# Altium schematic sheet Sheet1[1].SchDoc
size A; SheetNumber: 2; SheetTotal: 3; SPICEModelCacheXMSPVYCF: <root> / <DocumentId>XMSPVYCF</DocumentId> / <CacheFrame Number="0"> / <Model Name="18tq045" Kind="MDL"> / <Text>************************************** / *      Model Generated by MODPEX     * / *Copyright(c) Symmetry Design Systems* / *         All Rights Reserved        * / *    UNPUBLISHED LICENSED SOFTWARE   * / *   Contains Proprietary Information * / *      Which is The Property of      * / *     SYMMETRY OR ITS LICENSORS      * / *Commercial Use or Resale Restricted * / *   by Symmetry License Agreement    * / ************************************** / * Model generated on Sep 17, 96 / * MODEL FORMAT: SPICE3 / .MODEL 18tq045 d / +( / +IS=1.97424e-13 RS=0.00628392 N=0.530234 EG=0.6 / +XTI=0.05 BV=45 IBV=0.0001 CJO=8.24939e-09 / +VJ=1.5 M=0.462568 FC=0.5 TT=0 / +KF=0 AF=1 / +)</Text> / </Model> / </CacheFrame> / </root>
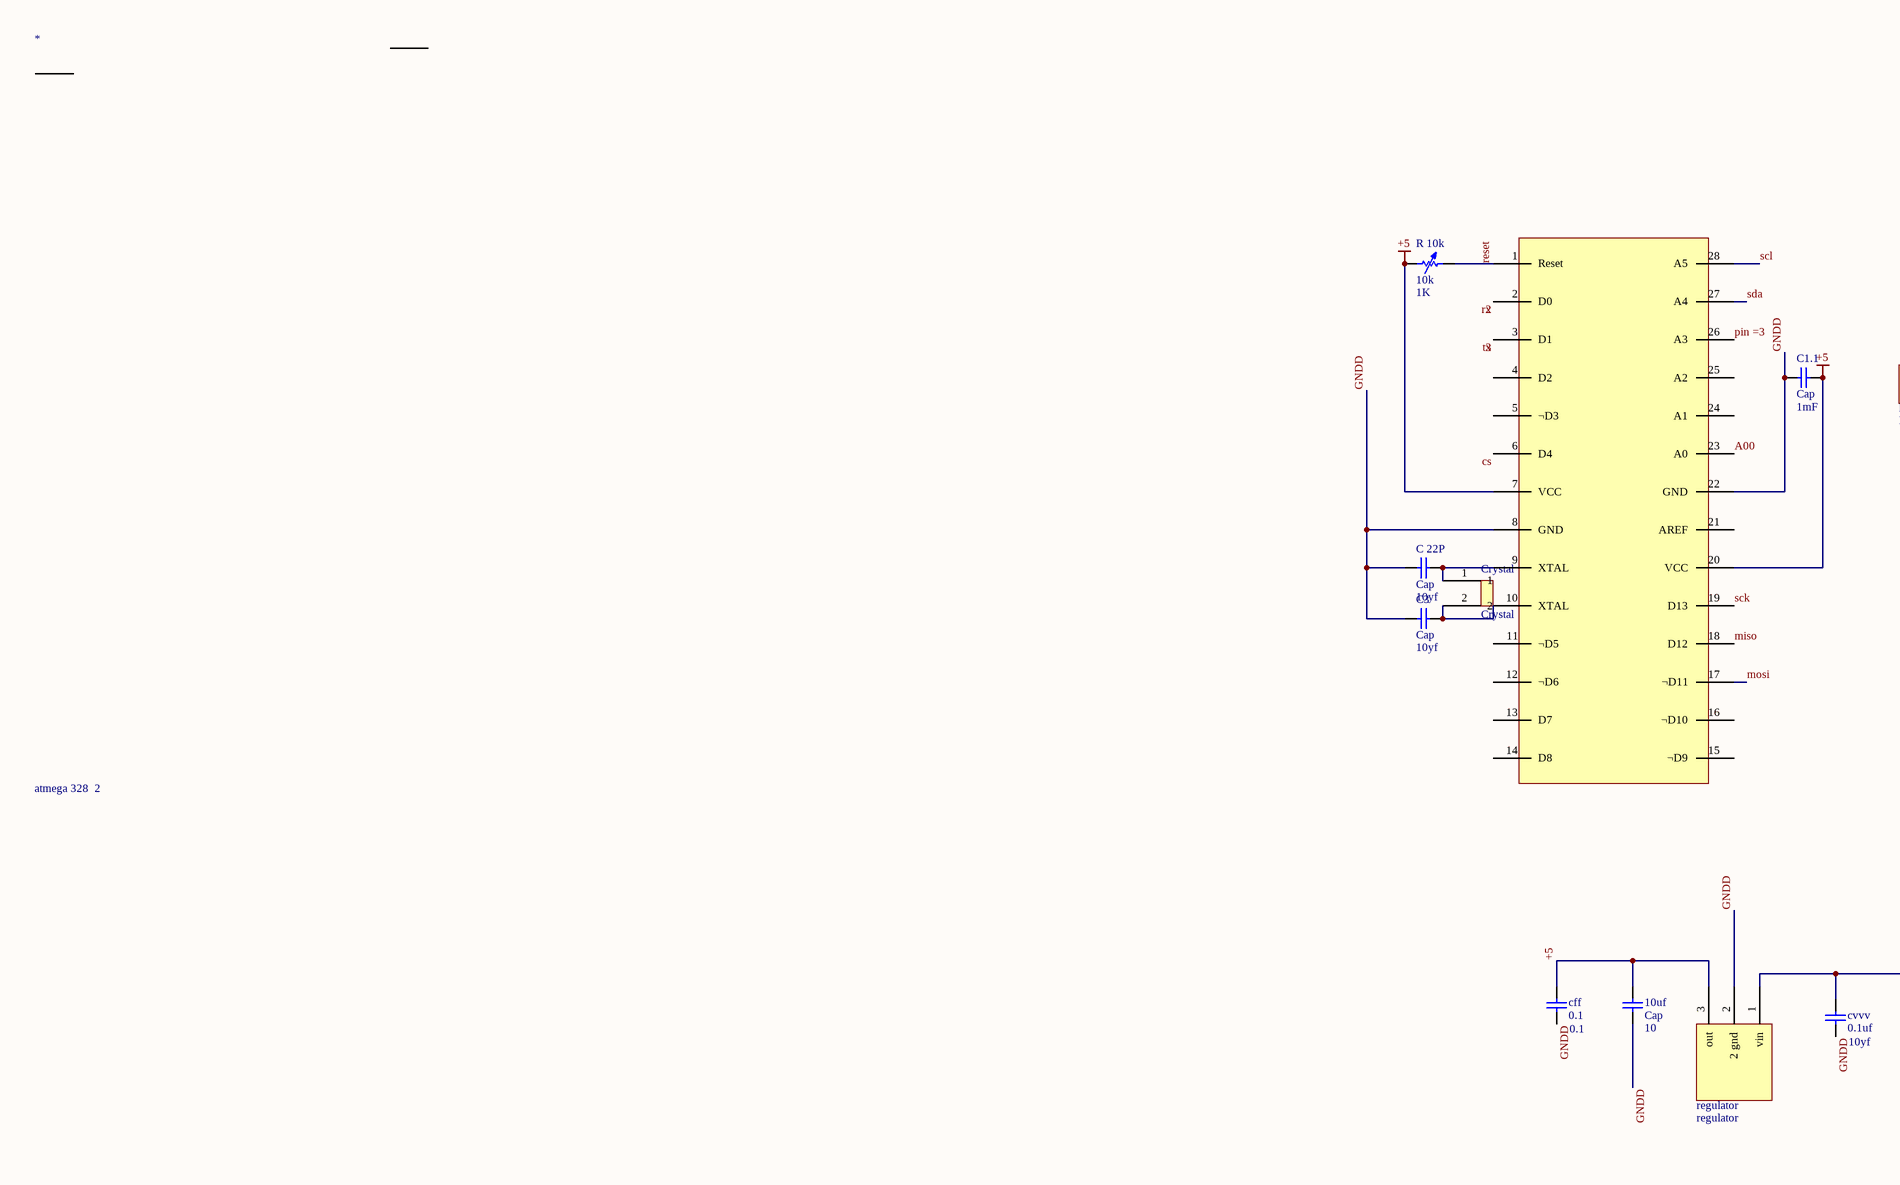
[diagram p0: Sheet1[1].SchDoc, left]
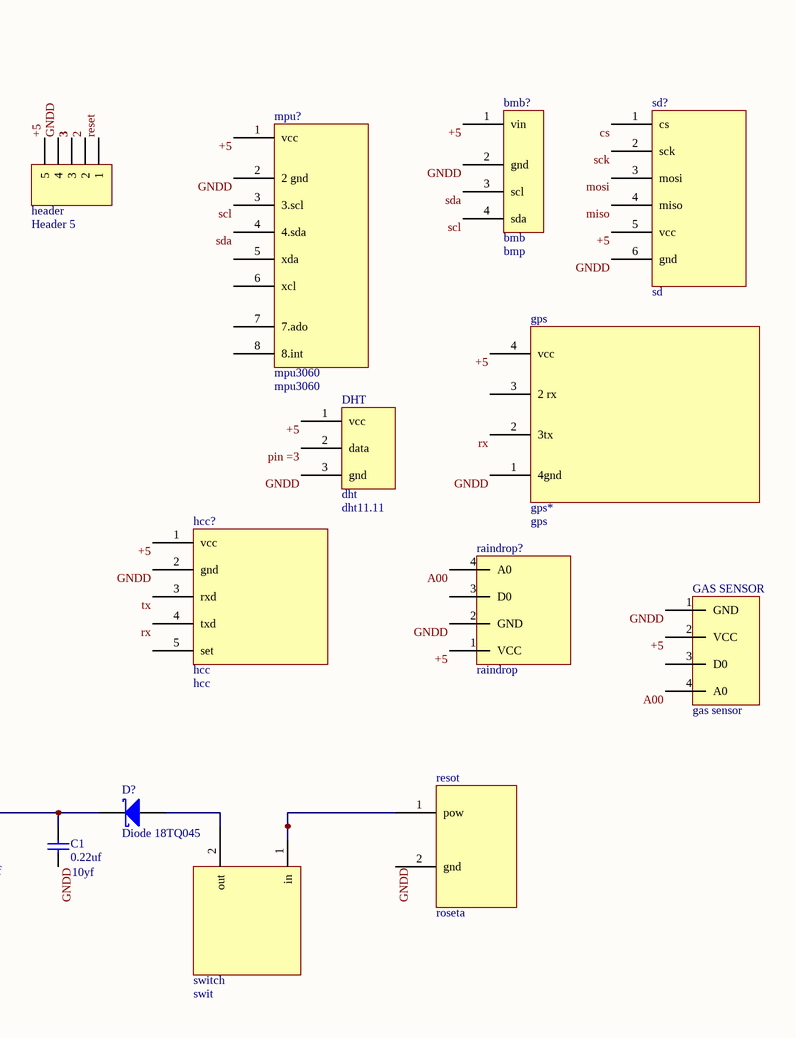
[diagram p1: Sheet1[1].SchDoc, right]

## Parts
10uf  Cap  value 10  [RAD-0.3]
*  atmega 328  2  [atmega 328p]
bmb?  bmb  [bmp - duplicate]
C1  0.22uf  10uf: 10yf  [RAD-0.3]
C1.1  Cap  value 1mF  [RAD-0.3]
C3  Cap  10uf: 10yf  [RAD-0.3]
C_22P  Cap  10uf: 10yf  [RAD-0.3]
cff  0.1  [RAD-0.3]
Crystal  Crystal  [cristal]
cvvv  0.1uf  10uf: 10yf  [RAD-0.3]
D?  Diode 18TQ045  [TO-220AC]
DHT  dht  [dht11.11]
GAS_SENSOR  gas sensor  [gas sensor]
gps  gps*  [GPS]
hcc?  hcc  [hc-12]
header  Header 5  [HDR1X5]
mpu?  mpu3060  [mpu 6050.11]
R_10k  10k  value 1K  [AXIAL-0.7]
raindrop?  raindrop  [raindrop]
regulator  regulator  [regylator]
resot  roseta  [roseta]
sd?  sd  [sd - duplicate]
switch  swit  [switch]

## Nets
+5: 10uf.2 *.7(VCC) *.20(VCC) bmb?.1(vin) C1.1.1 cff.2 DHT.1(vcc) GAS_SENSOR.2(VCC) gps.4(vcc) hcc?.1(vcc) header.5 mpu?.1(vcc) R_10k.1 raindrop?.1(VCC) regulator.3(out) sd?.5(vcc)
2: *.2(D0) gps.2(3tx) hcc?.4(txd) header.2  [also labelled rx]
3: *.3(D1) hcc?.3(rxd) header.3  [also labelled tx]
A00: *.23(A0) GAS_SENSOR.4(A0) raindrop?.4(A0)
cs: *.6(D4) sd?.1(cs)
GNDD: 10uf.1 *.8(GND) *.22(GND) bmb?.2(gnd) C1.1 C1.1.2 C3.2 C_22P.2 cff.1 cvvv.1 DHT.3(gnd) GAS_SENSOR.1(GND) gps.1(4gnd) hcc?.2(gnd) header.4 mpu?.2(2_gnd) raindrop?.2(GND) regulator.2(2_gnd) resot.2(gnd) sd?.6(gnd)
miso: *.18(D12) sd?.4(miso)
mosi: *.17(¬D11) sd?.3(mosi)
pin =3: *.26(A3) DHT.2(data)
reset: *.1(Reset) header.1 R_10k.2
sck: *.19(D13) sd?.2(sck)
scl: *.28(A5) bmb?.4(sda) mpu?.3(3.scl)
sda: *.27(A4) bmb?.3(scl) mpu?.4(4.sda)
Net*_9: *.9(XTAL) C_22P.1 Crystal.1
Net*_10: *.10(XTAL) C3.1 Crystal.2
NetC1_2: C1.2 cvvv.2 D?.1(K) regulator.1(vin)
NetD?_3: D?.3(A) switch.2(out)
Netresot_1: resot.1(pow) switch.1(in)

Not connected (* = marked no-connect by the designer): * 4(D2) 5(¬D3) 11(¬D5) 12(¬D6) 13(D7) 14(D8) 15(¬D9) 16(¬D10) 21(AREF) 24(A1) 25(A2); GAS_SENSOR 3(D0); gps 3(2_rx); hcc? 5(set); mpu? 5(xda) 6(xcl) 7(7.ado) 8(8.int); raindrop? 3(D0)

## Library data of the parts
10uf C1 C1.1 C3 C_22P cff cvvv = Cap: Capacitor; Published: 8-Jun-2000; LatestRevisionDate: 17-Jul-2002; LatestRevisionNote: Re-released for DXP Platform.; PackageReference: RAD-0.3; Publisher: Altium Limited; PackageDescription: Radial Cap, Thru-Hole; 2 Leads; 0.3 in Pin Spacing
  cff: 10uf: 0.1
bmb? = bmp: Parameter 1: *; catagorr: bmp
D? = Diode 18TQ045: Schottky Rectifier; Note: Terminal 2 is the TAB and is electrically connected to the cathode; Published: 8-Jun-2000; LatestRevisionDate: 17-Jul-2002; LatestRevisionNote: Re-released for DXP Platform.; DatasheetVersion: Dec-1997; PackageVersion: Feb-1998; PackageReference: TO-220AC; Publisher: Altium Limited; PackageDescription: TO, Thru-Hole, Vertical, Heatsink Mounted; 3 In-Line Leads (1 Absent); Pitch 2.54 mm; ComponentLink1Description: Manufacturer Link; ComponentLink1URL: http://www.irf.com/; ComponentLink2Description: Datasheet; ComponentLink2URL: http://www.irf.com/product-info/datasheets/data/18tq.pdf
gps = gps.neo.6m: gps: gps
hcc? = hc 12: hcc: hcc
header = Header 5: Header, 5-Pin; LatestRevisionDate: 17-Jul-2002; LatestRevisionNote: Re-released for DXP Platform.; Publisher: Altium Limited
mpu? = mpu: categore: mpu3060
R_10k = Res Adj1: Variable Resistor; Set Position: 0.5; Published: 8-Jun-2000; LatestRevisionDate: 17-Jul-2002; LatestRevisionNote: Re-released for DXP Platform.; PackageReference: AXIAL-0.7; Publisher: Altium Limited; PackageDescription: Axial Device, Thru-Hole; 2 Leads; 0.7 in Pin Spacing
* = atmega 328  2: category: atmega 328  2
Crystal = Crystal: CATEGORY: CRISTAL
DHT = dht: catagory: dht11.11
raindrop? = raindrop: category: raindrop
sd? = sd: sd: sd